# EAGLE design fuse-a-3 (EAGLE 9.6.2)
AUTHOR: Balazs Racz; DRAWING_TITLE: MEB Schalterwerk Projekt; LICENSE: Licensed by the Solderpad Hardware License V2.0; REVIEWER: n/a; REVISION: A3; YEAR: 2023
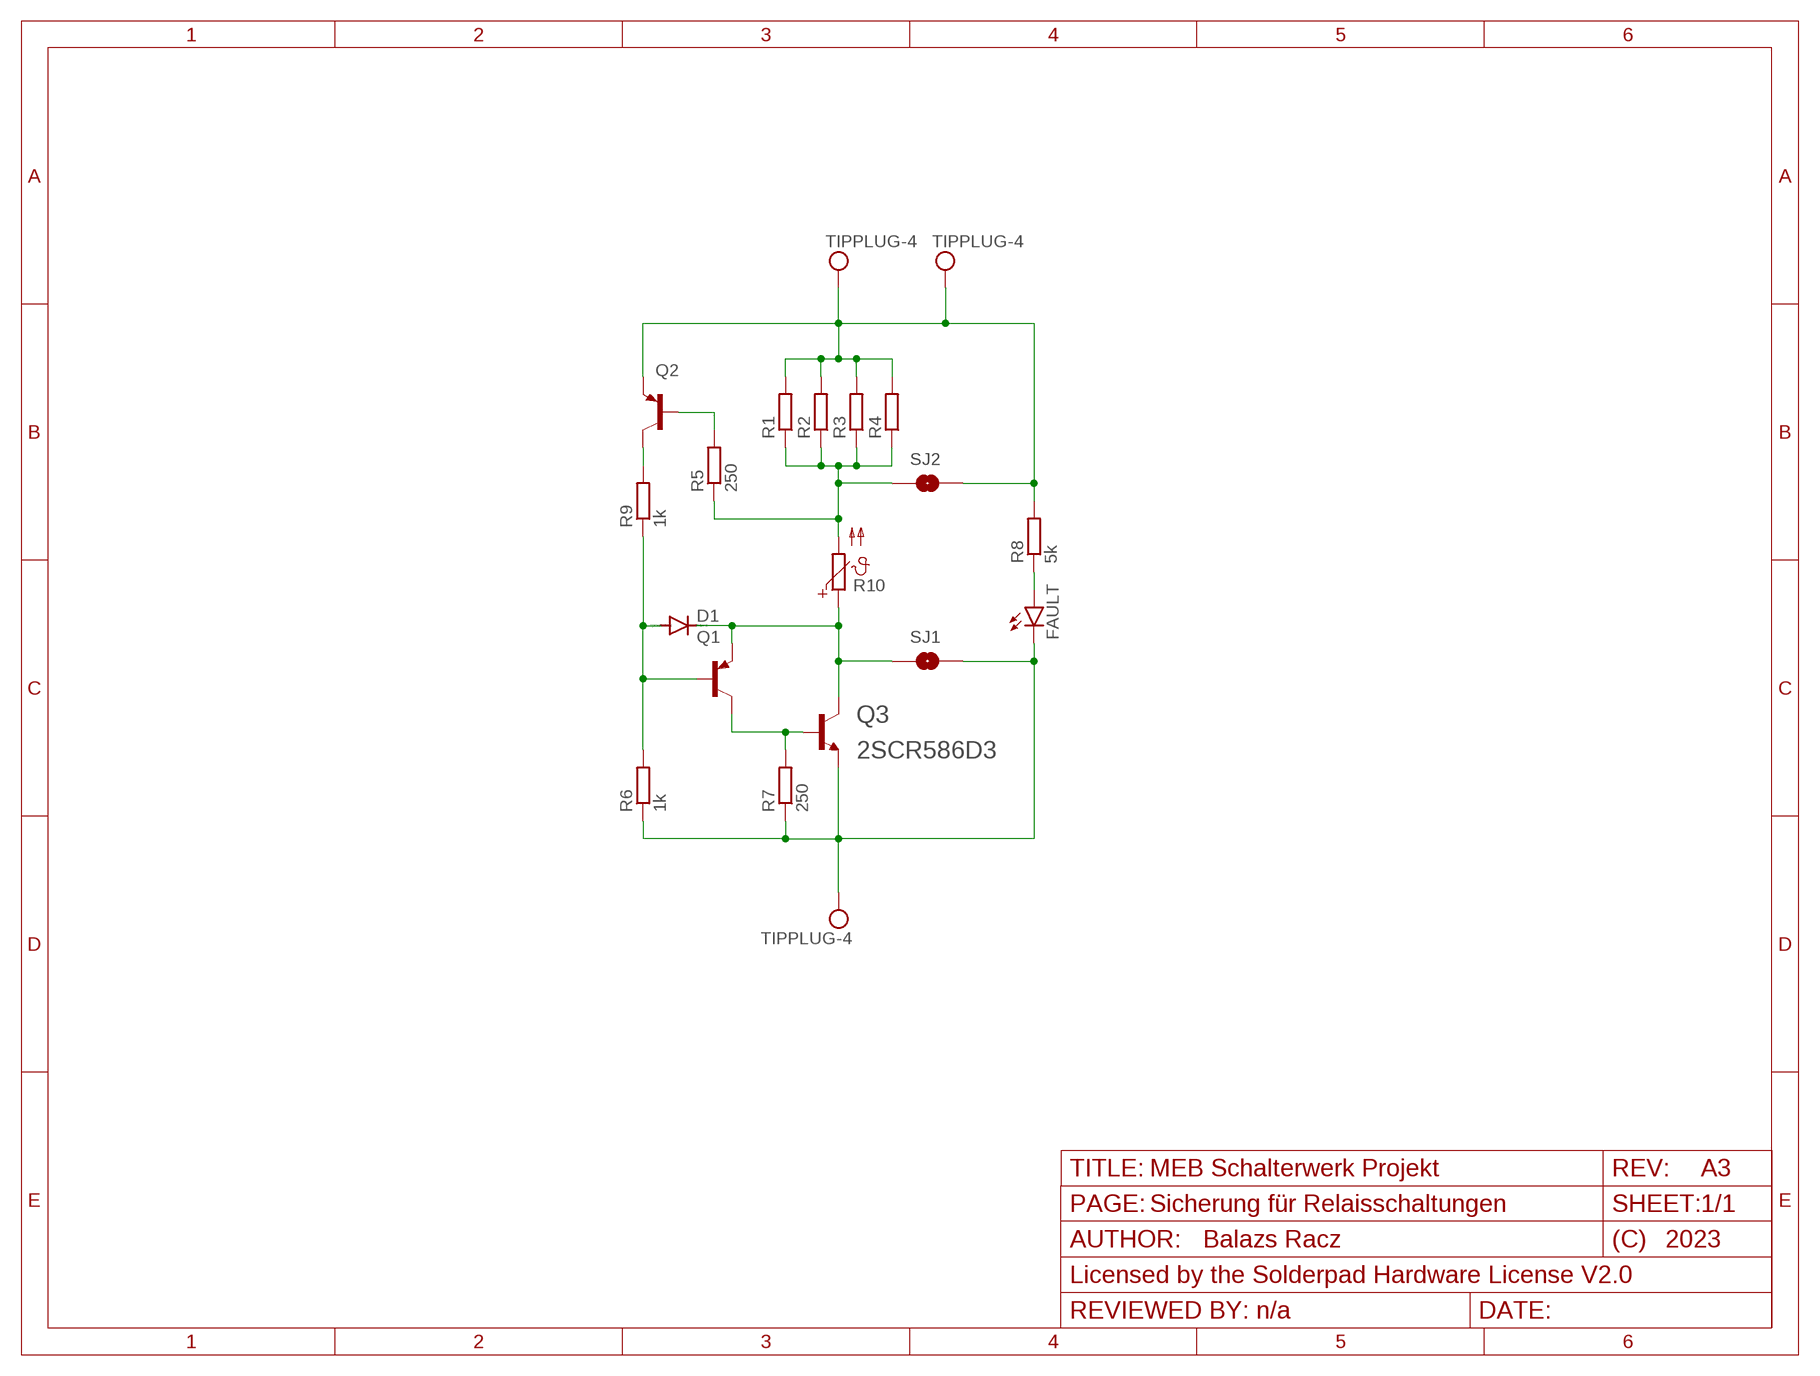
[diagram p0: schematic, sheet 1]
FRAME2 (FRAME_A_L): PAGE: Sicherung für Relaisschaltungen
FRAME3 (FRAME_A_L): PAGE: Input ports

## Parts
D1  DIODE-MINIMELF  [MINIMELF]
FAULT  LEDCHIPLED_0603  [CHIPLED_0603]
Q1  BCX71SMD  [SOT23]
Q2  BCX71SMD  [SOT23]
Q3  2SCR586D3  2SCR586D3TL1  [D-PAK_TO252AA]
R1  R-EU_R2512  [R2512]
R2  R-EU_R2512  [R2512]
R3  R-EU_R2512  [R2512]
R4  R-EU_R2512  [R2512]
R5  250  R-EU_R0805  [R0805]
R6  1k  R-EU_R0805  [R0805]
R7  250  R-EU_R0805  [R0805]
R8  5k  R-EU_R0805  [R0805]
R9  1k  R-EU_R0805  [R0805]
R10  PTC_1812  [PTC1812]
SJ1  SJRND2  [SJ_RND2]
SJ2  SJRND2  [SJ_RND2]
U$1  TIPPLUG-4  [BANANAPLUG-4-LUG]
U$2  TIPPLUG-4  [BANANAPLUG-4-LUG]
U$4  TIPPLUG-4  [BANANAPLUG-4-LUG]

## Nets
FUSEIN: R1.1 R2.1 R3.1 R4.1 R5.1 R10.2 SJ2.P$1
FUSEOUT: D1.C Q1.2(E) Q3.4(C) R10.1 SJ1.P$1
N$1: Q2.1(B) R5.2
N$4: D1.A Q1.1(B) R6.2 R9.1
N$5: Q1.3(C) Q3.1(B) R7.2
N$6: FAULT.A R8.1
N$8: Q2.3(C) R9.2
VIN: Q2.2(E) R1.2 R2.2 R3.2 R4.2 R8.2 SJ2.P$2 U$1.4MM($1) U$4.4MM($1)
VOUT: FAULT.C Q3.3(E) R6.1 R7.1 SJ1.P$2 U$2.4MM($1)

## Library data of the parts
D1 = diode:DIODE-: DIODE
FAULT = led:LED: LED OSRAM: - CHIPLED LG R971, LG N971, LY N971, LG Q971, LY Q971, LO R971, LY R971 LH N974, LH R974 LS Q976, LO Q976, LY Q976 LO Q996 - Hyper CHIPLED LW Q18S LB Q993, LB Q99A, LB R99A - SideLED LS A670, LO A670, LY A670, LG A670, LP A670 LB A673, LV A673, LT A673, LW A673 LH A674 LY A675 LS A676, LA A676, LO A676, LY A676, LW A676 LS A679, LY A679, LG A679 - Hyper Micro SIDELED® LS Y876, LA Y876, LO Y876, LY Y876 LT Y87S - SmartLED LW L88C, LW L88S LB L89C, LB L89S, LG L890 LS L89K, LO L89K, LY L89K LS L896, LA L896, LO L896, LY L896 - TOPLED LS T670, LO T670, LY T670, LG T670, LP T670 LSG T670, LSP T670, LSY T670, LOP T670, LYG T670 LG T671, LOG T671, LSG T671 LB T673, LV T673, LT T673, LW T673 LH T674 LS T676, LA T676, LO T676, LY T676, LB T676, LH T676, LSB T676, LW T676 LB T67C, LV T67C, LT T67C, LS T67K, LO T67K, LY T67K, LW E67C LS E67B, LA E67B, LO E67B, LY E67B, LB E67C, LV E67C, LT E67C LW T67C LS T679, LY T679, LG T679 LS T770, LO T770, LY T770, LG T770, LP T770 LB T773, LV T773, LT T773, LW T773 LH T774 LS E675, LA E675, LY E675, LS T675 LS T776, LA T776, LO T776, LY T776, LB T776 LHGB T686 LT T68C, LB T68C - Hyper Mini TOPLED® LB M676 - Mini TOPLED Santana® LG M470 LS M47K, LO M47K, LY M47K Source: http://www.osram.convergy.de LUXEON: - LUMILED® LXK2-PW12-R00, LXK2-PW12-S00, LXK2-PW14-U00, LXK2-PW14-V00 LXK2-PM12-R00, LXK2-PM12-S00, LXK2-PM14-U00 LXK2-PE12-Q00, LXK2-PE12-R00, LXK2-PE12-S00, LXK2-PE14-T00, LXK2-PE14-U00 LXK2-PB12-K00, LXK2-PB12-L00, LXK2-PB12-M00, LXK2-PB14-N00, LXK2-PB14-P00, LXK2-PB14-Q00 LXK2-PR12-L00, LXK2-PR12-M00, LXK2-PR14-Q00, LXK2-PR14-R00 LXK2-PD12-Q00, LXK2-PD12-R00, LXK2-PD12-S00 LXK2-PH12-R00, LXK2-PH12-S00 LXK2-PL12-P00, LXK2-PL12-Q00, LXK2-PL12-R00 Source: www.luxeon.com KINGBRIGHT: KA-3528ASYC Source: www.kingbright.com
Q1 Q2 = transistor-pnp:BCX71SMD: PNP Transistor
Q3 = eagleparts:2SCR586D3TL1
R1-R9 = rcl:R-EU_: RESISTOR, European symbol; SPICEPREFIX: R
R10 = tcs:PTC_: PHILIPS PTC
SJ1 SJ2 = eagleparts:SJ: SMD solder JUMPER
U$1 U$2 U$4 = eagleparts:TIPPLUG

## Board
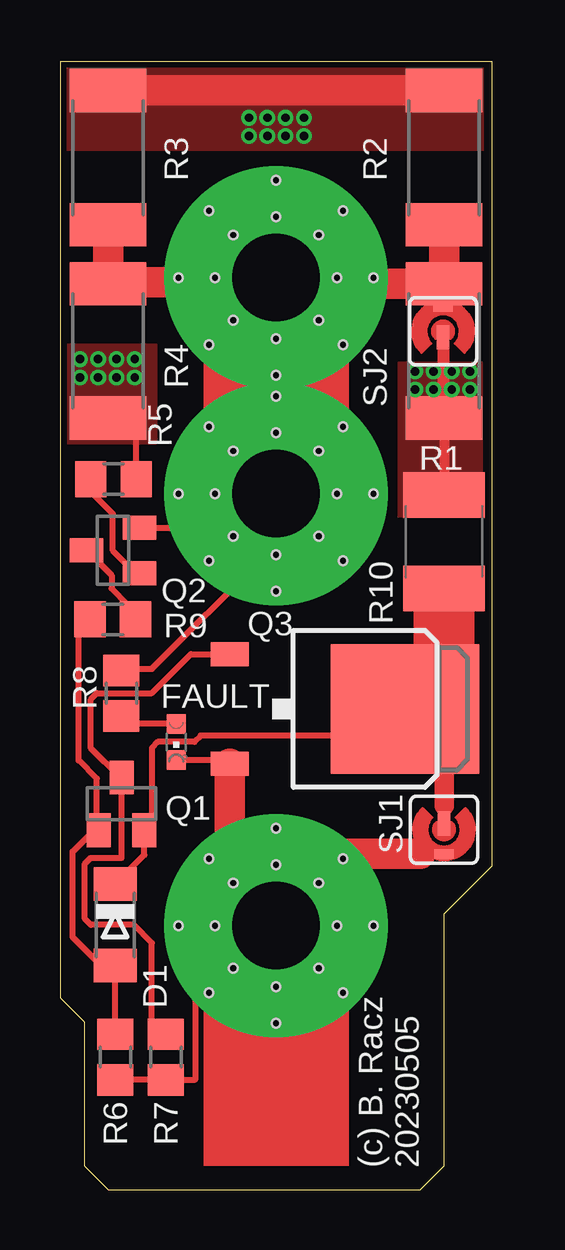
[diagram p1: board, top side]
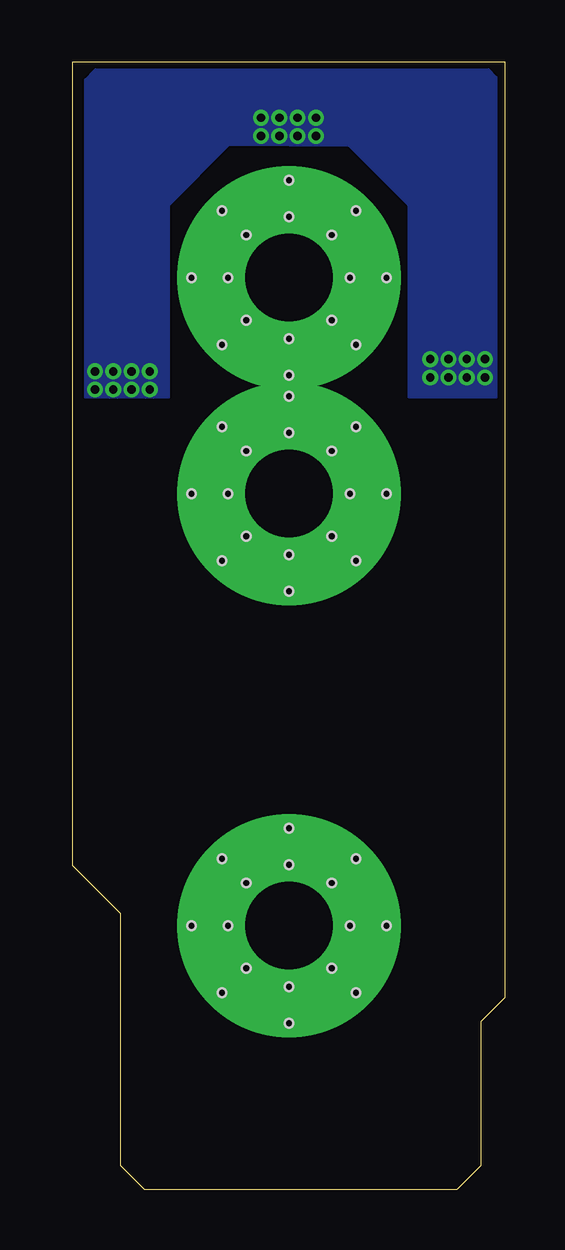
[diagram p2: board, bottom side, seen from below]

Size 18 x 47 mm. Coordinates in mm from the lower left corner, seen from the top.
Outline: 2,0 15,0 16,1 16,11.5 18,13.5 18,47 0,47 0,8 1,7 1,1 2,0
Copper layers (1*16): Top 0.035mm / dielectric 1.5mm / Bottom 0.035mm
Design rules "SeeedStudio_2layer_DRU_no_angle_20140221": minimum track width 6mil, minimum drill 12mil, track to track 6mil, track to pad 6mil, pad to pad 6mil, via to via 6mil, smd to smd 0mil, copper to edge 10mil, drill to drill 10mil, minimum pad ring 10mil, minimum via ring 6mil, stop-mask expansion 2mil, vias tented up to drill 100mil, thermal gap 10mil

### Footprints (pad centres in the part's own frame; a part is rotated, then mirrored left to right if it is on the bottom)
MINIMELF = smd 1.4 x 1.8: A 1.7,0; C -1.7,0
CHIPLED_0603 = smd 0.8 x 0.8: A 0,-0.75; C 0,0.75
SOT23 = smd 1 x 1.4: 1 -0.95,-1.1; 2 0.95,-1.1; 3 0,1.1
D-PAK_TO252AA = smd 1 x 1.6: 1 -2.28,-4.8; 3 2.28,-4.8 | smd 5.4 x 6.2: 4 0,2.5
R2512 = smd 1.8 x 3.2: 1 -2.8,0; 2 2.8,0
R0805 = smd 1.3 x 1.5: 1 -0.95,0; 2 0.95,0
PTC1812 = smd 1.9 x 3.4: 1 -1.95,0; 2 1.95,0
SJ_RND2 = smd 1.016 x 0.508: P$1 -0.254,0 | smd 0.406 x 0.813: P$2 1.016,0
BANANAPLUG-4-LUG = drill 3.65 pad 9.3: 4MM 0,0 | hole 0.35: 0,2.54; 0,-2.54; 2.54,0; -2.54,0; -1.778,1.778; 1.778,1.778; 1.778,-1.778; -1.778,-1.778; 0,4.064; 4.064,0; -4.064,0; 0,-4.064; 2.794,-2.794; -2.794,-2.794; -2.794,2.794; 2.794,2.794

### Placement (x,y rotation side)
D1  2.3,11.03 270 top
FAULT  4.84,18.65 180 top
Q1  2.57,16.08 0 top
Q2  2.21,26.64 90 top
Q3  11.87,20.03 270 top
R1  16,34.95 90 top
R2  16,43 270 top
R3  2,43 270 top
R4  2,34.95 90 top
R5  2.23,29.61 180 top
R6  2.3,5.52 90 top
R7  4.41,5.52 90 top
R8  2.56,20.69 90 top
R9  2.2,23.76 0 top
R10  16,27 90 top
SJ1  16,15 270 top
SJ2  15.96,35.77 90 top
U$1  9,29 90 top
U$2  9,11 270 top
U$4  9,38 270 top

### Tracks (layer width: path | path; a pad name or v marks a point on that pad's centre or on a via)
FUSEIN  (via drill 0.35)
  Top 0.254: R5.1 3.17,31.5 2.52,32.15 R4.1
  Top 0.406: R1.1 R10.2
  Top 0.508: SJ2.P$1 15.96,32.19 R1.1
  Top 1.27: R3.1 R2.1
  other vias: 14.8,34.1 15.56,34.1 16.32,34.1 17.08,34.1 7.88,43.9 8.64,43.9 9.4,43.9 10.16,43.9 7.88,44.67 8.64,44.67 9.4,44.67 10.16,44.67 0.83,33.84 1.59,33.84 2.35,33.84 3.11,33.84 3.11,34.61 2.35,34.61 1.59,34.61 0.83,34.61 14.8,33.34 15.56,33.34 16.32,33.34 17.08,33.34
  pour Top (no thermals): 14.09,28.05 17.59,28.05 17.59,34.45 14.09,34.45
  pour Top (no thermals): 17.64,43.33 17.64,46.75 0.27,46.75 0.27,43.33
  pour Bottom: 14,33 17.49,33 17.49,46.25 17.06,46.68 0.68,46.68 0.36,46.36 0.36,33 4,33 4,41 6.48,43.48 11.52,43.52 14,41
  pour Top (no thermals): 0.32,31.1 4.03,31.1 4.03,35.21 0.32,35.21
FUSEOUT
  Top 0.254: 16,18.91 15.49,18.91 5.86,18.91 5.6,18.65 4.08,18.65 3.83,18.4 3.83,15.29 Q1.2 3.52,13.95 D1.C
  Top 0.406: 16,24 R10.1
  Top 0.508: SJ1.P$1 16,16
  Top 0.813: 16,16 16,18.91 | 15.49,18.91 Q3.4
  Top 2.54: Q3.4 16,21.66 16,24
N$1
  Top 0.254: Q2.1 3.14,25.69 2.2,26.63 2.2,28.15 1.27,29.08 R5.2
N$4
  Top 0.254: R6.2 D1.A 1.72,9.33 0.52,10.53 0.52,14.08 1.42,14.98 Q1.1 1.54,15.05 1.54,17.13 0.78,17.89 0.78,23.29 R9.1
N$5
  Top 0.254: Q3.1 5.45,22.31 3.83,20.69 1.54,20.69 1.29,20.43 1.29,18.4 2.51,17.18 Q1.3 2.57,13.84 2.56,13.83 1.29,13.83 1.03,13.57 1.03,11.29 1.29,11.03 3.06,11.03 3.83,10.27 3.83,7.05 R7.2
N$6
  Top 0.254: FAULT.A 2.89,19.4 R8.1
N$8
  Top 0.254: Q2.3 2.15,25.6 2.15,25.05 2.81,24.39 2.86,24.39 3.15,24.11 R9.2
VIN
  Top 0.254: Q2.2 7.59,27.59 U$1.4MM 9,27.8 9,27.78 9,27.25 8.44,26.69 8.44,26.32 3.83,21.7 2.62,21.7 R8.2 | R1.2 16,36.83 SJ2.P$2
  Top 1.016: U$4.4MM 9,34.66
  Top 1.27: R2.2 R1.2 9,37.75 | R3.2 2,38.2 2.23,37.98 | 2.23,37.98 R4.2 | 2.23,37.98 2.4,37.8 9,37.8 9,37.75 | 9,37.75 9,34.66 U$1.4MM
VOUT
  Top 0.254: FAULT.C 6.92,17.9 Q3.3 | U$2.4MM 9,10.21 7.45,8.67 6.53,8.67 6.44,8.76 5.98,8.76 5.65,8.44 5.65,4.61 5.61,4.57 R7.1 R6.1
  Top 0.406: 15,14 15.98,14 SJ1.P$2
  Top 0.813: 7.07,12.93 U$2.4MM
  Top 1.27: Q3.3 7.07,12.93 | U$2.4MM 12,14 15,14

### Text on the board
tNames: (c) B. Racz / 20230505